# EAGLE schematic  Placa V.5 (EAGLE 8.3.1)

## Sheet 1 of 7: Controlador
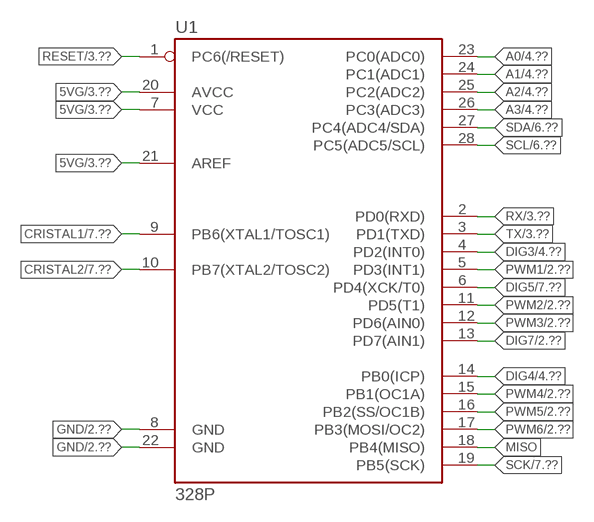
[diagram p0: schematic, sheet 1]

### Parts
U1  328P  ATMEGA328P_PDIP  [DIP28]

### Nets
5VG: U1.7(VCC) U1.20(AVCC) U1.21(AREF) ; also sheet 3,4,5,6,7
A0: U1.23(PC0(ADC0)) ; also sheet 4
A1: U1.24(PC1(ADC1)) ; also sheet 4
A2: U1.25(PC2(ADC2)) ; also sheet 4
A3: U1.26(PC3(ADC3)) ; also sheet 4
CRISTAL1: U1.9(PB6(XTAL1/TOSC1)) ; also sheet 7
CRISTAL2: U1.10(PB7(XTAL2/TOSC2)) ; also sheet 7
DIG3: U1.4(PD2(INT0)) ; also sheet 4
DIG4: U1.14(PB0(ICP)) ; also sheet 4
DIG5: U1.6(PD4(XCK/T0)) ; also sheet 7
DIG7: U1.13(PD7(AIN1)) ; also sheet 2
GND: U1.8(GND) U1.22(GND) ; also sheet 2,3,4,5,6,7
MISO: U1.18(PB4(MISO))
PWM1: U1.5(PD3(INT1)) ; also sheet 2
PWM2: U1.11(PD5(T1)) ; also sheet 2
PWM3: U1.12(PD6(AIN0)) ; also sheet 2
PWM4: U1.15(PB1(OC1A)) ; also sheet 2
PWM5: U1.16(PB2(SS/OC1B)) ; also sheet 2
PWM6: U1.17(PB3(MOSI/OC2)) ; also sheet 2
RESET: U1.1(PC6(/RESET)) ; also sheet 3,7
RX: U1.2(PD0(RXD)) ; also sheet 3
SCK: U1.19(PB5(SCK)) ; also sheet 7
SCL: U1.28(PC5(ADC5/SCL)) ; also sheet 6
SDA: U1.27(PC4(ADC4/SDA)) ; also sheet 6
TX: U1.3(PD1(TXD)) ; also sheet 3

## Sheet 2 of 7: Servos
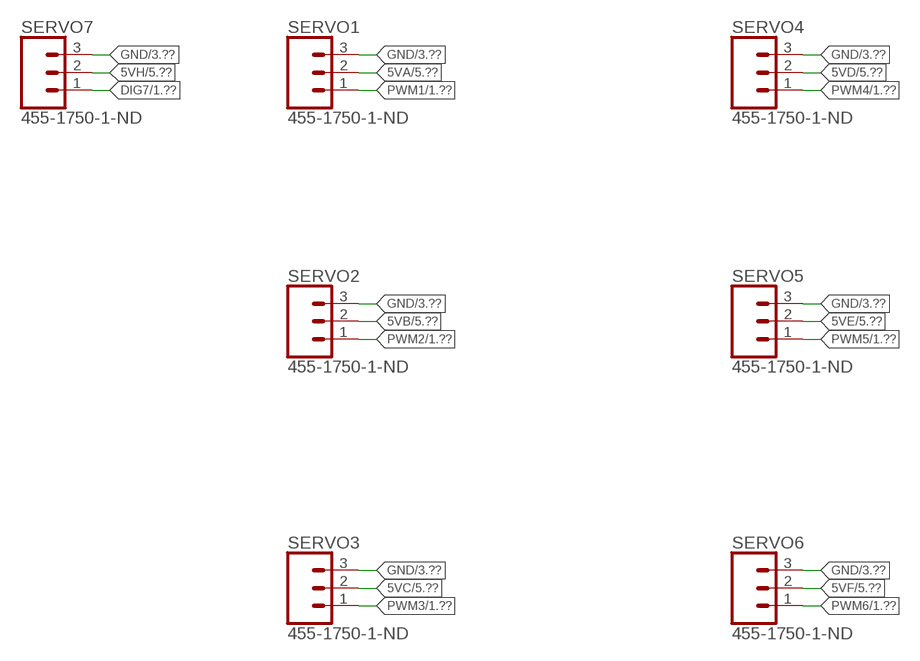
[diagram p1: schematic, sheet 2]

### Parts
SERVO1  455-1750-1-ND  CONN_03  [1X03]
SERVO2  455-1750-1-ND  CONN_03  [1X03]
SERVO3  455-1750-1-ND  CONN_03  [1X03]
SERVO4  455-1750-1-ND  CONN_03  [1X03]
SERVO5  455-1750-1-ND  CONN_03  [1X03]
SERVO6  455-1750-1-ND  CONN_03  [1X03]
SERVO7  455-1750-1-ND  CONN_03  [1X03]

### Nets
5VA: SERVO1.2 ; also sheet 5
5VB: SERVO2.2 ; also sheet 5
5VC: SERVO3.2 ; also sheet 5
5VD: SERVO4.2 ; also sheet 5
5VE: SERVO5.2 ; also sheet 5
5VF: SERVO6.2 ; also sheet 5
5VH: SERVO7.2 ; also sheet 5
DIG7: SERVO7.1 ; also sheet 1
GND: SERVO1.3 SERVO2.3 SERVO3.3 SERVO4.3 SERVO5.3 SERVO6.3 SERVO7.3 ; also sheet 1,3,4,5,6,7
PWM1: SERVO1.1 ; also sheet 1
PWM2: SERVO2.1 ; also sheet 1
PWM3: SERVO3.1 ; also sheet 1
PWM4: SERVO4.1 ; also sheet 1
PWM5: SERVO5.1 ; also sheet 1
PWM6: SERVO6.1 ; also sheet 1

## Sheet 3 of 7: FTDI
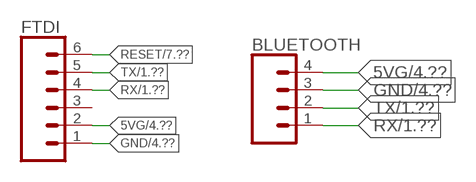
[diagram p2: schematic, sheet 3]

### Parts
BLUETOOTH  CONN_04  [1X04]
FTDI  CONN_06SILK_FEMALE_PTH  [1X06]

### Nets
5VG: BLUETOOTH.4 FTDI.2 ; also sheet 1,4,5,6,7
GND: BLUETOOTH.3 FTDI.1 ; also sheet 1,2,4,5,6,7
RESET: FTDI.6 ; also sheet 1,7
RX: BLUETOOTH.1 FTDI.4 ; also sheet 1
TX: BLUETOOTH.2 FTDI.5 ; also sheet 1
Unconnected: FTDI.3

## Sheet 4 of 7: Encoder
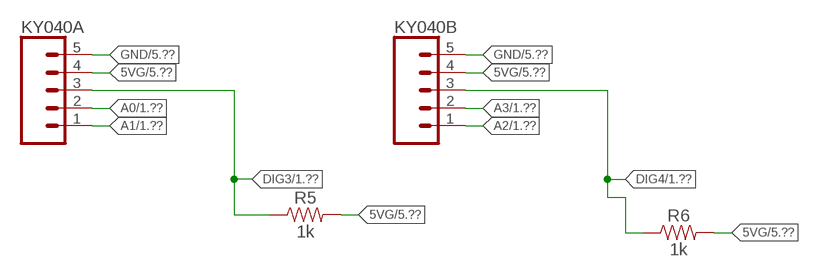
[diagram p3: schematic, sheet 4]

### Parts
KY040A  CONN_05  [1X05]
KY040B  CONN_05  [1X05]
R5  1k  1KOHM-HORIZ-1/4W-1%  [AXIAL-0.3]
R6  1k  1KOHM-HORIZ-1/4W-1%  [AXIAL-0.3]

### Nets
5VG: KY040A.4 KY040B.4 R5.P$2 R6.P$2 ; also sheet 1,3,5,6,7
A0: KY040A.2 ; also sheet 1
A1: KY040A.1 ; also sheet 1
A2: KY040B.1 ; also sheet 1
A3: KY040B.2 ; also sheet 1
DIG3: KY040A.3 R5.P$1 ; also sheet 1
DIG4: KY040B.3 R6.P$1 ; also sheet 1
GND: KY040A.5 KY040B.5 ; also sheet 1,2,3,5,6,7

## Sheet 5 of 7: Alimentacão
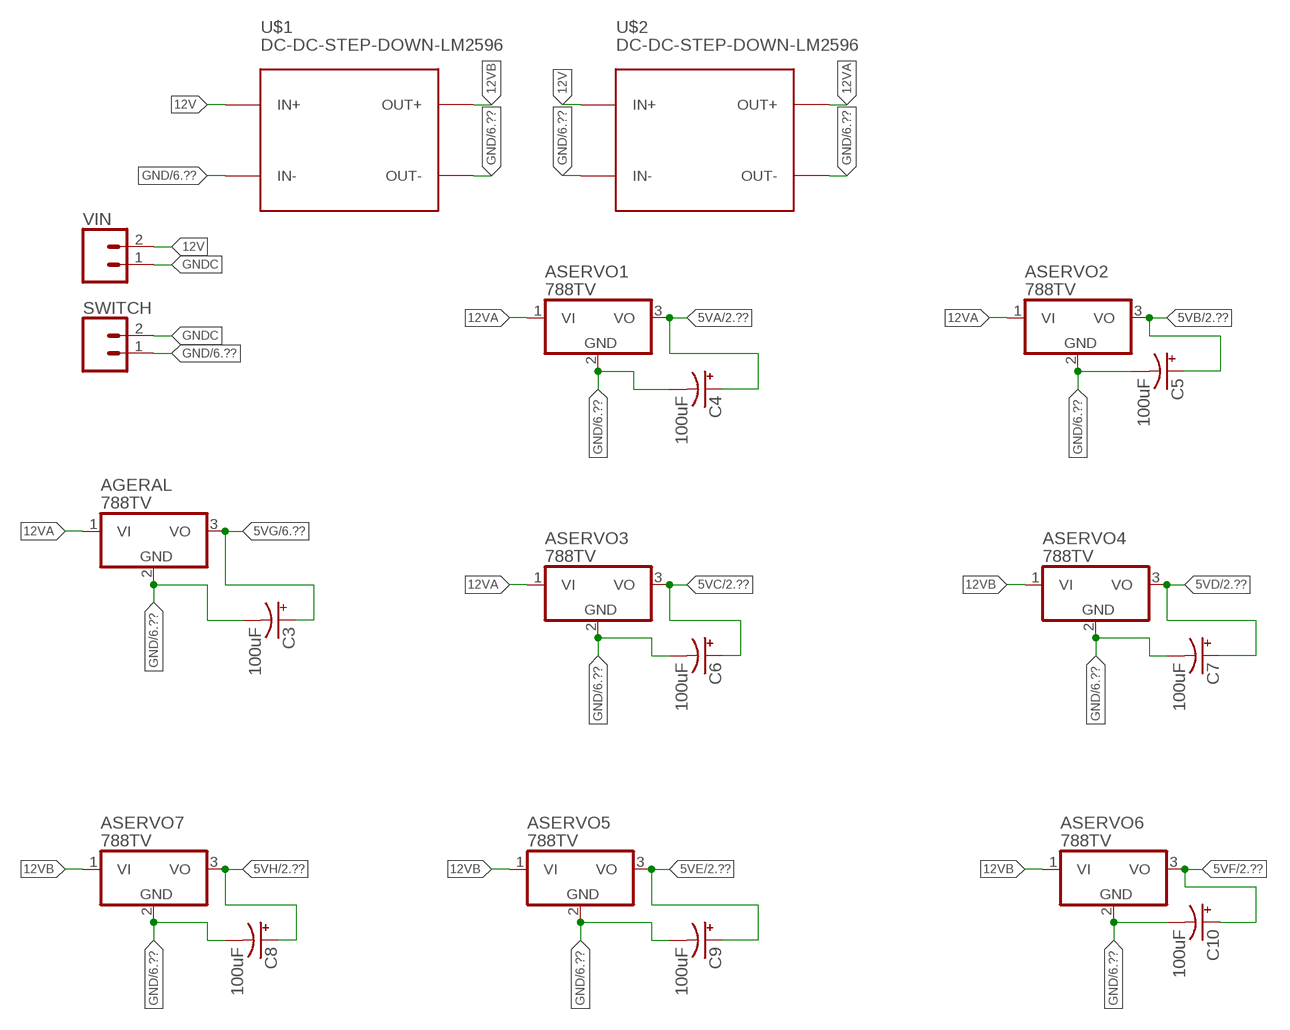
[diagram p4: schematic, sheet 5]

### Parts
AGERAL  788TV  [TO220V]
ASERVO1  788TV  [TO220V]
ASERVO2  788TV  [TO220V]
ASERVO3  788TV  [TO220V]
ASERVO4  788TV  [TO220V]
ASERVO5  788TV  [TO220V]
ASERVO6  788TV  [TO220V]
ASERVO7  788TV  [TO220V]
C3  100uF  100UF-POLAR-RADIAL-2.5MM-25V-20%  [CPOL-RADIAL-2.5MM-6.5MM]
C4  100uF  100UF-POLAR-RADIAL-2.5MM-25V-20%  [CPOL-RADIAL-2.5MM-6.5MM]
C5  100uF  100UF-POLAR-RADIAL-2.5MM-25V-20%  [CPOL-RADIAL-2.5MM-6.5MM]
C6  100uF  100UF-POLAR-RADIAL-2.5MM-25V-20%  [CPOL-RADIAL-2.5MM-6.5MM]
C7  100uF  100UF-POLAR-RADIAL-2.5MM-25V-20%  [CPOL-RADIAL-2.5MM-6.5MM]
C8  100uF  100UF-POLAR-RADIAL-2.5MM-25V-20%  [CPOL-RADIAL-2.5MM-6.5MM]
C9  100uF  100UF-POLAR-RADIAL-2.5MM-25V-20%  [CPOL-RADIAL-2.5MM-6.5MM]
C10  100uF  100UF-POLAR-RADIAL-2.5MM-25V-20%  [CPOL-RADIAL-2.5MM-6.5MM]
SWITCH  CONN_02  [1X02]
U$1  DC-DC-STEP-DOWN-LM2596  [DC-DC-STEP-DOWN-LM2596]
U$2  DC-DC-STEP-DOWN-LM2596  [DC-DC-STEP-DOWN-LM2596]
VIN  CONN_02  [1X02]

### Nets
5VA: ASERVO1.3(VO) C4.1(+) ; also sheet 2
5VB: ASERVO2.3(VO) C5.1(+) ; also sheet 2
5VC: ASERVO3.3(VO) C6.1(+) ; also sheet 2
5VD: ASERVO4.3(VO) C7.1(+) ; also sheet 2
5VE: ASERVO5.3(VO) C9.1(+) ; also sheet 2
5VF: ASERVO6.3(VO) C10.1(+) ; also sheet 2
5VG: AGERAL.3(VO) C3.1(+) ; also sheet 1,3,4,6,7
5VH: ASERVO7.3(VO) C8.1(+) ; also sheet 2
12V: U$1.IN+ U$2.IN+ VIN.2
12VA: AGERAL.1(VI) ASERVO1.1(VI) ASERVO2.1(VI) ASERVO3.1(VI) U$2.OUT+
12VB: ASERVO4.1(VI) ASERVO5.1(VI) ASERVO6.1(VI) ASERVO7.1(VI) U$1.OUT+
GND: AGERAL.2(GND) ASERVO1.2(GND) ASERVO2.2(GND) ASERVO3.2(GND) ASERVO4.2(GND) ASERVO5.2(GND) ASERVO6.2(GND) ASERVO7.2(GND) C3.2(-) C4.2(-) C5.2(-) C6.2(-) C7.2(-) C8.2(-) C9.2(-) C10.2(-) SWITCH.1 U$1.IN- U$1.OUT- U$2.IN- U$2.OUT- ; also sheet 1,2,3,4,6,7
GNDC: SWITCH.2 VIN.1

## Sheet 6 of 7: LCD
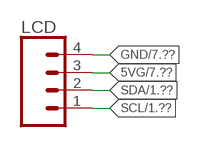
[diagram p5: schematic, sheet 6]

### Parts
LCD  CONN_04  [1X04]

### Nets
5VG: LCD.3 ; also sheet 1,3,4,5,7
GND: LCD.4 ; also sheet 1,2,3,4,5,7
SCL: LCD.1 ; also sheet 1
SDA: LCD.2 ; also sheet 1

## Sheet 7 of 7: Outros
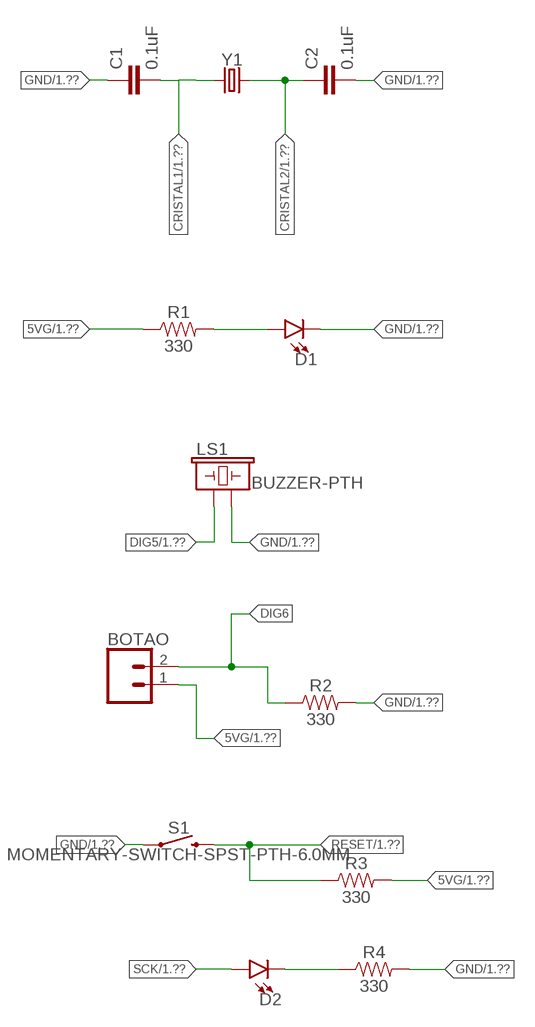
[diagram p6: schematic, sheet 7]

### Parts
BOTAO  CONN_02  [1X02]
C1  0.1uF  0.1UF-KIT-EZ-50V-20%  [CAP-PTH-SMALL-KIT]
C2  0.1uF  0.1UF-KIT-EZ-50V-20%  [CAP-PTH-SMALL-KIT]
D1  LED5MM  [LED_5MM]
D2  LED5MM  [LED_5MM]
LS1  BUZZER-PTH  [BUZZER-12MM]
R1  330  330OHM-HORIZ-1/10W-5%  [AXIAL-0.3]
R2  330  330OHM-HORIZ-1/10W-5%  [AXIAL-0.3]
R3  330  330OHM-HORIZ-1/10W-5%  [AXIAL-0.3]
R4  330  330OHM-HORIZ-1/10W-5%  [AXIAL-0.3]
S1  MOMENTARY-SWITCH-SPST-PTH-6.0MM  [TACTILE_SWITCH_PTH_6.0MM]
Y1  CRYSTALPTH-HC49US  [HC49US]

### Nets
5VG: BOTAO.1 R1.P$1 R3.P$2 ; also sheet 1,3,4,5,6
CRISTAL1: C1.2 Y1.1 ; also sheet 1
CRISTAL2: C2.1 Y1.2 ; also sheet 1
DIG5: LS1.+ ; also sheet 1
DIG6: BOTAO.2 R2.P$1
GND: C1.1 C2.2 D1.K(C) LS1.- R2.P$2 R4.P$2 S1.1 ; also sheet 1,2,3,4,5,6
N$2: D1.A R1.P$2
N$4: D2.K(C) R4.P$1
RESET: R3.P$1 S1.3 ; also sheet 1,3
SCK: D2.A ; also sheet 1

## Library data of the parts
AGERAL ASERVO1-ASERVO7 = linear:78*: Positive VOLTAGE REGULATOR Source: http://cache.national.com/ds/LM/LM78L05.pdf http://www.fairchildsemi.com/ds/LM/LM7805.pdf
BLUETOOTH LCD = SparkFun-Connectors:CONN_04: Multi connection point. Often used as Generic Header-pin footprint for 0.1 inch spaced/style header connections On any of the 0.1 inch spaced packages, you can populate with these: Break Away Headers - Straight <https://www.sparkfun.com/products/116> (PRT-00116) Break Away Male Headers - Right Angle <https://www.sparkfun.com/products/553> (PRT-00553) Female Headers <https://www.sparkfun.com/products/115> (PRT-00115) Break Away Headers - Machine Pin <https://www.sparkfun.com/products/117> (PRT-00117) Break Away Female Headers - Swiss Machine Pin <https://www.sparkfun.com/products/743> (PRT-00743) For SCREWTERMINALS and SPRING TERMINALS visit here: Screw Terimnals on SparkFun.com <https://www.sparkfun.com/search/results?term=Screw+Terminals> (5mm/3.5mm/2.54mm spacing) This device is also useful as a general connection point to wire up your design to another part of your project. Our various solder wires solder well into these plated through hole pads. Hook-Up Wire - Assortment (Stranded, 22 AWG) <https://www.sparkfun.com/products/11375> (PRT-11375) Hook-Up Wire - Assortment (Solid Core, 22 AWG) <https://www.sparkfun.com/products/11367> (PRT-11367) View the entire wire category on our website here <https://www.sparkfun.com/categories/141> Special notes: Molex polarized connector foot print use with SKU : PRT-08231 with associated crimp pins and housings. 1MM SMD Version SKU: PRT-10208; PROD_ID: CONN-09696
BOTAO SWITCH VIN = SparkFun-Connectors:CONN_02: Multi connection point. Often used as Generic Header-pin footprint for 0.1 inch spaced/style header connections On any of the 0.1 inch spaced packages, you can populate with these: Break Away Headers - Straight <https://www.sparkfun.com/products/116> (PRT-00116) Break Away Male Headers - Right Angle <https://www.sparkfun.com/products/553> (PRT-00553) Female Headers <https://www.sparkfun.com/products/115> (PRT-00115) Break Away Headers - Machine Pin <https://www.sparkfun.com/products/117> (PRT-00117) Break Away Female Headers - Swiss Machine Pin <https://www.sparkfun.com/products/743> (PRT-00743) For SCREWTERMINALS and SPRING TERMINALS visit here: Screw Terimnals on SparkFun.com <https://www.sparkfun.com/search/results?term=Screw+Terminals> (5mm/3.5mm/2.54mm spacing) This device is also useful as a general connection point to wire up your design to another part of your project. Our various solder wires solder well into these plated through hole pads. Hook-Up Wire - Assortment (Stranded, 22 AWG) <https://www.sparkfun.com/products/11375> (PRT-11375) Hook-Up Wire - Assortment (Solid Core, 22 AWG) <https://www.sparkfun.com/products/11367> (PRT-11367) View the entire wire category on our website here <https://www.sparkfun.com/categories/141> Special notes: Molex polarized connector foot print use with: PRT-08233 with associated crimp pins and housings. 2.54_SCREWTERM for use with PRT-10571. 3.5mm Screw Terminal footprints for PRT-08084 5mm Screw Terminal footprints for use with PRT-08432
C1 C2 = SparkFun-Capacitors:0.1UF: 0.1µF ceramic capacitors A capacitor is a passive two-terminal electrical component used to store electrical energy temporarily in an electric field.; PROD_ID: CAP-08370
C3-C10 = SparkFun-Capacitors:100UF-POLAR: 100µF polarized capacitors A capacitor is a passive two-terminal electrical component used to store electrical energy temporarily in an electric field.; PROD_ID: CAP-08439
D1 D2 = SparkFun-LED:LED: LED (Generic) Standard schematic elements and footprints for 5mm, 3mm, 1206, and 0603 sized LEDs. Generic LEDs with no color specified.
FTDI = SparkFun-Connectors:CONN_06: Multi connection point. Often used as Generic Header-pin footprint for 0.1 inch spaced/style header connections On any of the 0.1 inch spaced packages, you can populate with these: Break Away Headers - Straight <https://www.sparkfun.com/products/116> (PRT-00116) Break Away Male Headers - Right Angle <https://www.sparkfun.com/products/553> (PRT-00553) Female Headers <https://www.sparkfun.com/products/115> (PRT-00115) Break Away Headers - Machine Pin <https://www.sparkfun.com/products/117> (PRT-00117) Break Away Female Headers - Swiss Machine Pin <https://www.sparkfun.com/products/743> (PRT-00743) Arduino Stackable Header - 6 Pin <https://www.sparkfun.com/products/9280> (PRT-09280) For SCREWTERMINALS and SPRING TERMINALS visit here: Screw Terimnals on SparkFun.com <https://www.sparkfun.com/search/results?term=Screw+Terminals> (5mm/3.5mm/2.54mm spacing) This device is also useful as a general connection point to wire up your design to another part of your project. Our various solder wires solder well into these plated through hole pads. Hook-Up Wire - Assortment (Stranded, 22 AWG) <https://www.sparkfun.com/products/11375> (PRT-11375) Hook-Up Wire - Assortment (Solid Core, 22 AWG) <https://www.sparkfun.com/products/11367> (PRT-11367) View the entire wire category on our website here <https://www.sparkfun.com/categories/141>; PROD_ID: CONN-08437
KY040A KY040B = SparkFun-Connectors:CONN_05: Multi connection point. Often used as Generic Header-pin footprint for 0.1 inch spaced/style header connections On any of the 0.1 inch spaced packages, you can populate with these: Break Away Headers - Straight <https://www.sparkfun.com/products/116> (PRT-00116) Break Away Male Headers - Right Angle <https://www.sparkfun.com/products/553> (PRT-00553) Female Headers <https://www.sparkfun.com/products/115> (PRT-00115) Break Away Headers - Machine Pin <https://www.sparkfun.com/products/117> (PRT-00117) Break Away Female Headers - Swiss Machine Pin <https://www.sparkfun.com/products/743> (PRT-00743) For SCREWTERMINALS and SPRING TERMINALS visit here: Screw Terimnals on SparkFun.com <https://www.sparkfun.com/search/results?term=Screw+Terminals> (5mm/3.5mm/2.54mm spacing) This device is also useful as a general connection point to wire up your design to another part of your project. Our various solder wires solder well into these plated through hole pads. Hook-Up Wire - Assortment (Stranded, 22 AWG) <https://www.sparkfun.com/products/11375> (PRT-11375) Hook-Up Wire - Assortment (Solid Core, 22 AWG) <https://www.sparkfun.com/products/11367> (PRT-11367) View the entire wire category on our website here <https://www.sparkfun.com/categories/141> Special notes: Molex polarized connector foot print use with SKU : PRT-08231 with associated crimp pins and housings. 1MM SMD Version SKU: PRT-10208
LS1 = SparkFun-Electromechanical:BUZZER: Buzzer Small round buzzers that operate around the audible 2kHz range. You can use these as speakers to create simple music or user interfaces. Variant Overview: PTH - Mini Speaker - PC Mount 12mm 2.048kHz <https://www.sparkfun.com/products/7950> PTH_KIT - Mini Speaker - PC Mount 12mm 2.048kHz <https://www.sparkfun.com/products/7950> KIT simplifies soldering by adding stop mask to one side of the pads. PTH_NO_SILK - Mini Speaker - PC Mount 12mm 2.048kHz <https://www.sparkfun.com/products/7950> No silkscreen indicator of buzzer outline. PTH_KIT_NO_SILK - Mini Speaker - PC Mount 12mm 2.048kHz <https://www.sparkfun.com/products/7950> KIT package w/o silkscreen SMD - Buzzer Audio Magnetic (CCV-084B16) SMD buzzer used on, e.g. the LilyPad Buzzer <https://www.sparkfun.com/products/8463> and RFID USB Reader <https://www.sparkfun.com/products/9963>. SMD_KIT - Buzzer Audio Magnetic (CCV-084B16) SMD Buzzer with elongated pins to make soldering easier. Used on the SparkFun Simon Says - Surface Mount Soldering Kit <https://www.sparkfun.com/products/10935>.; PROD_ID: COMP-08253; SF_SKU: COM-07950
R1-R4 = SparkFun-Resistors:330OHM: 330Ω resistor A resistor is a passive two-terminal electrical component that implements electrical resistance as a circuit element. Resistors act to reduce current flow, and, at the same time, act to lower voltage levels within circuits. - Wikipedia; PROD_ID: RES-8371
R5 R6 = SparkFun-Resistors:1KOHM: 1kΩ resistor A resistor is a passive two-terminal electrical component that implements electrical resistance as a circuit element. Resistors act to reduce current flow, and, at the same time, act to lower voltage levels within circuits. - Wikipedia; PROD_ID: RES-12182
S1 = SparkFun-Switches:MOMENTARY-SWITCH-SPST: Momentary Switch (Pushbutton) - SPST Normally-open (NO) SPST momentary switches (buttons, pushbuttons). Variants PTH-12MM - 12mm square, through-hole Momentary Pushbutton Switch - 12mm Square <https://www.sparkfun.com/products/9190> (COM-09190) PTH-6.0MM, PTH-6.0MM-KIT - 6.0mm square, through-hole Mini Pushbutton Switch <https://www.sparkfun.com/products/97> (COM-00097) KIT package intended for soldering kit's - only one side of pads' copper is exposed. PTH-RIGHT-ANGLE-KIT - Right-angle, through-hole Right Angle Tactile Button <https://www.sparkfun.com/products/10791> - Used on SparkFun BigTime Watch Kit <https://www.sparkfun.com/products/11734> SMD-12MM - 12mm square, surface-mount Tactile Button - SMD (12mm) <https://www.sparkfun.com/products/12993> (COM-12993) Used on SparkFun PicoBoard <https://www.sparkfun.com/products/11888> SMD-4.5MM - 4.5mm Square Trackball Switch Used on SparkFun Blackberry Trackballer Breakout <https://www.sparkfun.com/products/13169> SMD-4.6MMX2.8MM - 4.60mm x 2.80mm, surface mount Used on SparkFun SAMD21 Mini Breakout <https://www.sparkfun.com/products/13664> SMD-5.2MM, SMD-5.2-REDUNDANT - 5.2mm square, surface-mount Mini Pushbutton Switch - SMD <https://www.sparkfun.com/products/8720> (COM-08720) Used on Arduino Pro Mini <https://www.sparkfun.com/products/11114> REDUNDANT package connects both switch circuits together SMD-6.0X3.5MM - 6.0 x 3.5mm, surface mount Momentary Reset Switch SMD <https://www.sparkfun.com/products/8229> (COM-08229) SMD-6.2MM-TALL - 6.2mm square, surface mount Tactile Button - SMD (6mm) <https://www.sparkfun.com/products/12992> Used on SparkFun Digital Sandbox <https://www.sparkfun.com/products/12651> SMD-RIGHT-ANGLE - Right-angle, surface mount Used on SparkFun Block for Intel® Edison - Arduino <https://www.sparkfun.com/products/13036>; PROD_ID: SWCH-08441; SF_SKU: COM-00097
SERVO1-SERVO7 = SparkFun-Connectors:CONN_03: Multi connection point. Often used as Generic Header-pin footprint for 0.1 inch spaced/style header connections On any of the 0.1 inch spaced packages, you can populate with these: Break Away Headers - Straight <https://www.sparkfun.com/products/116> (PRT-00116) Break Away Male Headers - Right Angle <https://www.sparkfun.com/products/553> (PRT-00553) Female Headers <https://www.sparkfun.com/products/115> (PRT-00115) Break Away Headers - Machine Pin <https://www.sparkfun.com/products/117> (PRT-00117) Break Away Female Headers - Swiss Machine Pin <https://www.sparkfun.com/products/743> (PRT-00743) Stackable Header - 3 Pin (Female, 0.1") <https://www.sparkfun.com/products/13875> (PRT-13875) For SCREWTERMINALS and SPRING TERMINALS visit here: Screw Terimnals on SparkFun.com <https://www.sparkfun.com/search/results?term=Screw+Terminals> (5mm/3.5mm/2.54mm spacing) This device is also useful as a general connection point to wire up your design to another part of your project. Our various solder wires solder well into these plated through hole pads. Hook-Up Wire - Assortment (Stranded, 22 AWG) <https://www.sparkfun.com/products/11375> (PRT-11375) Hook-Up Wire - Assortment (Solid Core, 22 AWG) <https://www.sparkfun.com/products/11367> (PRT-11367) View the entire wire category on our website here <https://www.sparkfun.com/categories/141> Special notes: Molex polarized connector foot print use with SKU : PRT-08232 with associated crimp pins and housings.; PROD_ID: XXX-00000
U1 = SparkFun-IC-Microcontroller:ATMEGA328P_PDIP: Atmel 328P Through hole ATMEGA328P uC used in the Arduino 32kb flash, 1k EEPROM, 2k SRAM Datasheet <http://www.sparkfun.com/datasheets/Components/SMD/ATMega328.pdf> SparkFun Products Storefront component: AVR 28 Pin 20MHz 32K 6A/D - ATMega328P <https://www.sparkfun.com/products/9061> (COM-09061) SparkFun Simon Says - Through-Hole Soldering Kit <https://www.sparkfun.com/products/10547> (KIT-10547) SparkFun Learn to Solder - Simon Says <https://www.sparkfun.com/products/13708> (KIT-13708) SparkFun BigTime Watch Kit <https://www.sparkfun.com/products/11734> (KIT-11734) SparkFun ClockIt <https://www.sparkfun.com/products/10930> (KIT-10930) SparkFun Serial Enabled LCD Kit <https://www.sparkfun.com/products/10097> (LCD-10097) SparkFun Simon Tilts - Through Hole Soldering Kit <https://www.sparkfun.com/products/12634> (KIT-12634) SparkFun Frequency Counter Kit <https://www.sparkfun.com/products/10140> (KIT-10140) FabFM Radio Kit <https://www.sparkfun.com/products/11043> (KIT-11043) SparkFun Binary Blaster Kit <https://www.sparkfun.com/products/12037> (KIT-12037) SparkFun Metro-Gnome <https://www.sparkfun.com/products/9236> (KIT-09236) ATmega328 with Arduino Optiboot (Uno) <https://www.sparkfun.com/products/10524> (DEV-10524); PROD_ID: IC-09136
U$1 U$2 = diy-modules:DC-DC-STEP-DOWN-LM2596: DC/DC Step-Down Regulator based on LM2596-ADJ chip LM2596 datasheet available here: http://www.ti.com/lit/ds/symlink/lm2596.pdf Click here to find device on ebay.com <http://www.ebay.com/sch/lm2596+power+regulator>
Y1 = SparkFun-Clocks:CRYSTAL: Crystals (Generic) These are passive quartz crystals, which can be used as a clock source for a microcontroller. Crystal's are two-terminal devices. They require external "load" capacitors to generate an oscillating signal.